# Altium schematic sheet karmanDB_transceiver.SchDoc
size A
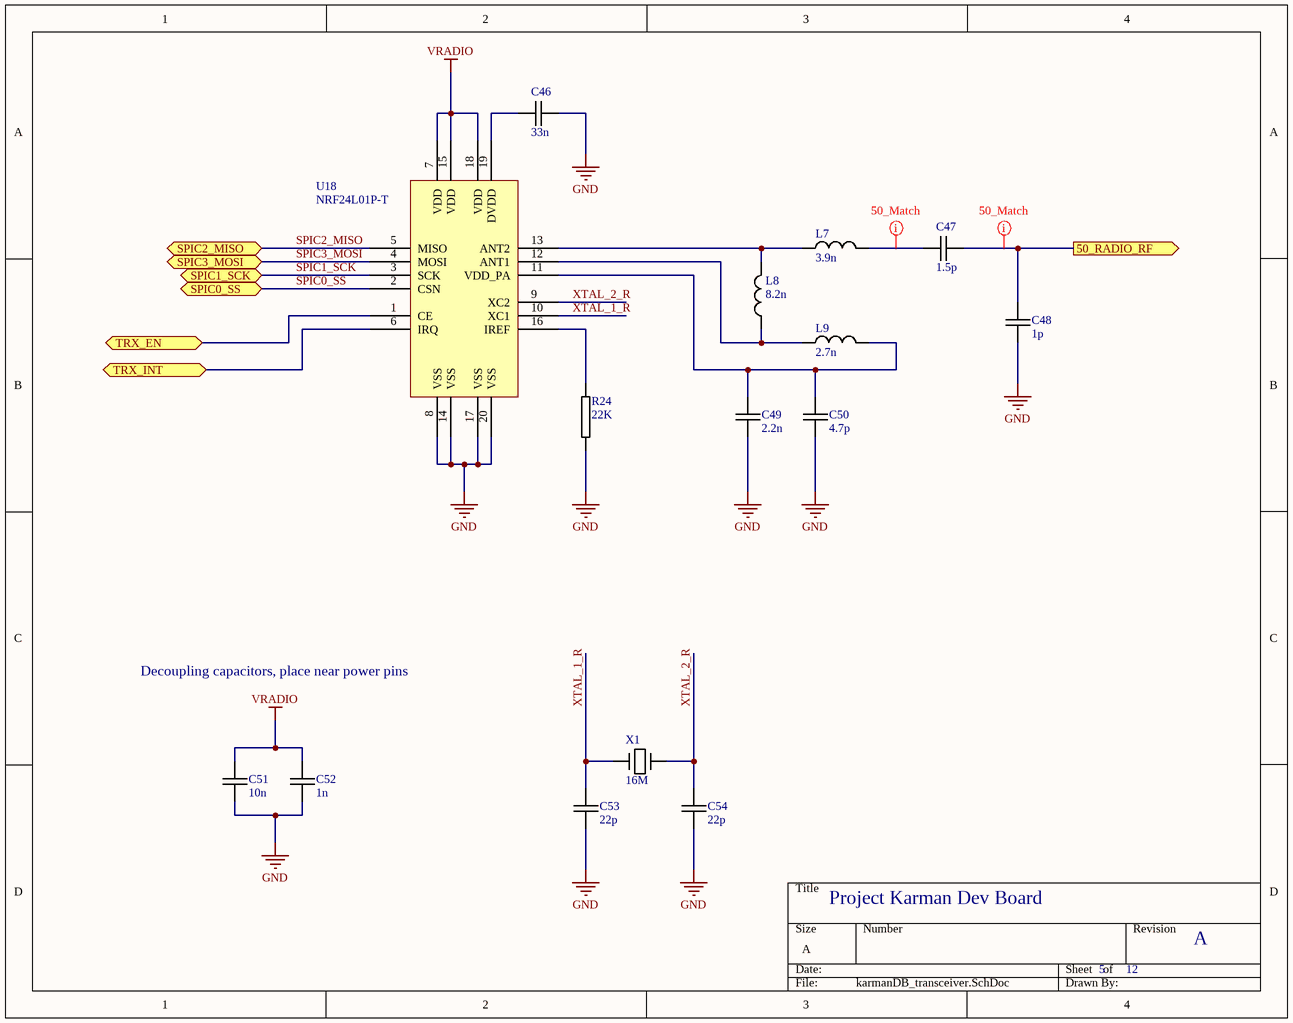
[diagram p0: karmanDB_transceiver.SchDoc]

## Parts
C46  33n  [MURATA_GRM_0603]
C47  1.5p  [MURATA_GRM_0402]
C48  1p  [MURATA_GRM_0402]
C49  2.2n  [MURATA_GRM_0402]
C50  4.7p  [MURATA_GRM_0402]
C51  10n  [MURATA_GRM_0603]
C52  1n  [MURATA_GRM_0603]
C53  22p  [MURATA_GRM_0603]
C54  22p  [MURATA_GRM_0603]
L7  3.9n  [PANASONIC_ELJRF]
L8  8.2n  [PANASONIC_ELJRF]
L9  2.7n  [PANASONIC_ELJRF]
R24  22K  [PANASONIC_ERJ3R]
U18  Manufacturer Part Number: NRF24L01P-T  [NORDIC_nRF24L01P]  (hidden comment: NORDIC_NRF24L01P)
X1  16M  [TXC_7B_SERIES]

## Ports
50_RADIO_RF (out), SPIC0_SS (bidir), SPIC1_SCK (bidir), SPIC2_MISO (bidir), SPIC3_MOSI (bidir), TRX_EN (bidir), TRX_INT (bidir)

## Nets
GND: C46.2 C48.2 C49.2 C50.2 C51.2 C52.2 C53.2 C54.2 R24.2 U18.8(VSS) U18.14(VSS) U18.17(VSS) U18.20(VSS) X1.PAD
VRADIO: C51.1 C52.1 U18.7(VDD) U18.15(VDD) U18.18(VDD)
50_RADIO_RF: C47.2 C48.1 ; port 50_RADIO_RF
SPIC0_SS: U18.2(CSN) ; port SPIC0_SS
SPIC1_SCK: U18.3(SCK) ; port SPIC1_SCK
SPIC2_MISO: U18.5(MISO) ; port SPIC2_MISO
SPIC3_MOSI: U18.4(MOSI) ; port SPIC3_MOSI
TRX_EN: U18.1(CE) ; port TRX_EN
TRX_INT: U18.6(IRQ) ; port TRX_INT
XTAL_1_R: C53.1 U18.10(XC1) X1.XTAL_P
XTAL_2_R: C54.1 U18.9(XC2) X1.XTAL_N
NetC46_1: C46.1 U18.19(DVDD)
NetC47_1: C47.1 L7.2
NetC49_1: C49.1 C50.1 L9.2 U18.11(VDD_PA)
NetL7_1: L7.1 L8.2 U18.13(ANT2)
NetL8_1: L8.1 L9.1 U18.12(ANT1)
NetR24_1: R24.1 U18.16(IREF)

## Layout directives
net class 50_Match_Class: 50_RADIO_RF, NetC47_1

## Notes on the sheet
- Decoupling capacitors, place near power pins
- Project Karman Dev Board
- 5
- 12
- A

## Library data of the parts
C46 = CAP_MURATA_GRM188R71C333KA01D: CAP CER 0.033UF 16V 10% X7R 0603; Manufacturer: Murata Electronics North America; Capacitance: 0.033µF; Supplier 1: Digi-Key; Supplier Part Number 1: 490-1528-1-ND; Manufacturer Part Number: GRM188R71C333KA01D; RoHS: RoHS Compliant; Category: Capacitors; Stock 1: 112656; Pricing: 1=0.1, 10=0.054, 50=0.0292, 100=0.0248, 250=0.02024, 500=0.01732, 1000=0.0135 (USD); Packaging: Cut Tape (CT); Tolerance: ±10%; Voltage - Rated: 16V; Temperature Coefficient: X7R; Mounting Type: Surface Mount, MLCC; Operating Temperature: -55°C ~ 125°C; Applications: General Purpose; Ratings: -; Package / Case: 0603 (1608 Metric); Size / Dimension: 0.063" L x 0.031" W (1.60mm x 0.80mm); Height - Seated (Max): -; Thickness (Max): 0.035" (0.90mm); Lead Spacing: -; Features: -; Lead Style: -; ComponentLink1URL: http://www.murata.com/~/media/webrenewal/support/library/catalog/products/capacitor/mlcc/c02e.ashx; ComponentLink1Description: http://www.murata.com/~/media/webrenewal/support/library/catalog/products/capacitor/mlcc/c02e.ashx
C47 = CAP_MURATA_GJM1555C1H1R5BB01D: CAP CER 1.5PF 50V NP0 0402; Manufacturer: Murata Electronics North America; Tolerance: ±0.1pF; Temperature Coefficient: C0G, NP0; Supplier 1: Digi-Key; Supplier Part Number 1: 490-8087-1-ND; Manufacturer Part Number: GJM1555C1H1R5BB01D; RoHS: RoHS Compliant; Category: Capacitors; Stock 1: 3662; Pricing: 1=0.2, 10=0.14, 50=0.0804, 100=0.0664, 250=0.05588, 500=0.04682, 1000=0.03768, 5000=0.03185 (USD); Packaging: Cut Tape (CT); Capacitance: 1.5pF; Voltage - Rated: 50V; Mounting Type: Surface Mount, MLCC; Operating Temperature: -55°C ~ 125°C; Applications: RF, Microwave, High Frequency; Ratings: -; Package / Case: 0402 (1005 Metric); Size / Dimension: 0.039" L x 0.020" W (1.00mm x 0.50mm); Height - Seated (Max): -; Thickness (Max): 0.022" (0.55mm); Lead Spacing: -; Features: High Q, Low Loss; Lead Style: -; ComponentLink1URL: http://www.murata.com/~/media/webrenewal/support/library/catalog/products/capacitor/mlcc/c02e.ashx; ComponentLink1Description: http://www.murata.com/~/media/webrenewal/support/library/catalog/products/capacitor/mlcc/c02e.ashx
C48 = CAP_MURATA_GJM1555C1H1R0BB01D: CAP CER 1PF 50V NP0 0402; Manufacturer: Murata Electronics North America; Tolerance: ±0.1pF; Temperature Coefficient: C0G, NP0; Supplier 1: Digi-Key; Supplier Part Number 1: 490-6073-1-ND; Manufacturer Part Number: GJM1555C1H1R0BB01D; RoHS: RoHS Compliant; Category: Capacitors; Stock 1: 74934; Pricing: 1=0.2, 10=0.14, 25=0.1048, 50=0.0804, 100=0.0664, 250=0.05588, 500=0.04682, 1000=0.03768, 5000=0.03185 (USD); Packaging: Cut Tape (CT); Capacitance: 1pF; Voltage - Rated: 50V; Mounting Type: Surface Mount, MLCC; Operating Temperature: -55°C ~ 125°C; Applications: RF, Microwave, High Frequency; Ratings: -; Package / Case: 0402 (1005 Metric); Size / Dimension: 0.039" L x 0.020" W (1.00mm x 0.50mm); Height - Seated (Max): -; Thickness (Max): 0.022" (0.55mm); Lead Spacing: -; Features: High Q, Low Loss; Lead Style: -; ComponentLink1URL: http://www.murata.com/~/media/webrenewal/support/library/catalog/products/capacitor/mlcc/c02e.ashx; ComponentLink1Description: http://www.murata.com/~/media/webrenewal/support/library/catalog/products/capacitor/mlcc/c02e.ashx
C49 = MURATA_GRM155R71C222KA01D: CAP CER 2200PF 16V 10% X7R 0402; Manufacturer: Murata Electronics North America; Supplier 1: Digi-Key; Supplier Part Number 1: 490-6330-1-ND; Manufacturer Part Number: GRM155R71C222KA01D; RoHS: RoHS Compliant; Category: Capacitors; Stock 1: 28283; Pricing: 1=0.1, 10=0.023, 25=0.016, 50=0.0124, 100=0.0105, 250=0.00856, 500=0.00732, 1000=0.0057, 5000=0.00475 (USD); Packaging: Cut Tape (CT); Capacitance: 2200pF; Tolerance: ±10%; Voltage - Rated: 16V; Temperature Coefficient: X7R; Mounting Type: Surface Mount, MLCC; Operating Temperature: -55°C ~ 125°C; Applications: General Purpose; Ratings: -; Package / Case: 0402 (1005 Metric); Size / Dimension: 0.039" L x 0.020" W (1.00mm x 0.50mm); Height - Seated (Max): -; Thickness (Max): 0.022" (0.55mm); Lead Spacing: -; Features: -; Lead Style: *; ComponentLink1URL: http://www.murata.com/~/media/webrenewal/support/library/catalog/products/capacitor/mlcc/c02e.ashx; ComponentLink1Description: http://www.murata.com/~/media/webrenewal/support/library/catalog/products/capacitor/mlcc/c02e.ashx
C50 = MURATA_GRM1555C1H4R7CA01D: CAP CER 4.7PF 50V NP0 0402; Manufacturer: Murata Electronics North America; Tolerance: ±0.25pF; Temperature Coefficient: C0G, NP0; Supplier 1: Digi-Key; Supplier Part Number 1: 490-5874-1-ND; Manufacturer Part Number: GRM1555C1H4R7CA01D; RoHS: RoHS Compliant; Category: Capacitors; Stock 1: 317555; Pricing: 1=0.1, 10=0.021, 50=0.0114, 100=0.0096, 250=0.00788, 500=0.00674, 1000=0.00525, 5000=0.00438 (USD); Packaging: Cut Tape (CT); Capacitance: 4.7pF; Voltage - Rated: 50V; Mounting Type: Surface Mount, MLCC; Operating Temperature: -55°C ~ 125°C; Applications: General Purpose; Ratings: -; Package / Case: 0402 (1005 Metric); Size / Dimension: 0.039" L x 0.020" W (1.00mm x 0.50mm); Height - Seated (Max): -; Thickness (Max): 0.022" (0.55mm); Lead Spacing: -; Features: -; Lead Style: -; ComponentLink1URL: http://www.murata.com/~/media/webrenewal/support/library/catalog/products/capacitor/mlcc/c02e.ashx; ComponentLink1Description: http://www.murata.com/~/media/webrenewal/support/library/catalog/products/capacitor/mlcc/c02e.ashx
C51 = CAP_MURATA_GRM188R71H103MA01D: CAP CER 10000PF 50V 20% X7R 0603; Manufacturer: Murata Electronics North America; Supplier 1: Digi-Key; Supplier Part Number 1: 490-1511-1-ND; Manufacturer Part Number: GRM188R71H103MA01D; RoHS: RoHS Compliant; Category: Capacitors; Stock 1: 188245; Pricing: 1=0.1, 10=0.018, 50=0.0098, 100=0.0083, 250=0.00676, 500=0.00578, 1000=0.0045 (USD); Packaging: Cut Tape (CT); Capacitance: 10000pF; Tolerance: ±20%; Voltage - Rated: 50V; Temperature Coefficient: X7R; Mounting Type: Surface Mount, MLCC; Operating Temperature: -55°C ~ 125°C; Applications: General Purpose; Ratings: -; Package / Case: 0603 (1608 Metric); Size / Dimension: 0.063" L x 0.031" W (1.60mm x 0.80mm); Height - Seated (Max): -; Thickness (Max): 0.035" (0.90mm); Lead Spacing: -; Features: -; Lead Style: -; ComponentLink1URL: http://www.murata.com/~/media/webrenewal/support/library/catalog/products/capacitor/mlcc/c02e.ashx; ComponentLink1Description: http://www.murata.com/~/media/webrenewal/support/library/catalog/products/capacitor/mlcc/c02e.ashx
C52 = CAP_MURATA_GRM188R71H102KA01D: CAP CER 1000PF 50V 10% X7R 0603; Manufacturer: Murata Electronics North America; Supplier 1: Digi-Key; Supplier Part Number 1: 490-1494-1-ND; Manufacturer Part Number: GRM188R71H102KA01D; RoHS: RoHS Compliant; Category: Capacitors; Stock 1: 1211591; Pricing: 1=0.1, 10=0.02, 50=0.0108, 100=0.0091, 250=0.00744, 500=0.00636, 1000=0.00495 (USD); Packaging: Cut Tape (CT); Capacitance: 1000pF; Tolerance: ±10%; Voltage - Rated: 50V; Temperature Coefficient: X7R; Mounting Type: Surface Mount, MLCC; Operating Temperature: -55°C ~ 125°C; Applications: General Purpose; Ratings: -; Package / Case: 0603 (1608 Metric); Size / Dimension: 0.063" L x 0.031" W (1.60mm x 0.80mm); Height - Seated (Max): -; Thickness (Max): 0.035" (0.90mm); Lead Spacing: -; Features: -; Lead Style: -; ComponentLink1URL: http://www.murata.com/~/media/webrenewal/support/library/catalog/products/capacitor/mlcc/c02e.ashx; ComponentLink1Description: http://www.murata.com/~/media/webrenewal/support/library/catalog/products/capacitor/mlcc/c02e.ashx
C53 C54 = CAP_MURATA_GRM1885C1H220JA01D: CAP CER 22PF 50V 5% NP0 0603; Manufacturer: Murata Electronics North America; Temperature Coefficient: C0G, NP0; Supplier 1: Digi-Key; Supplier Part Number 1: 490-1411-1-ND; Manufacturer Part Number: GRM1885C1H220JA01D; RoHS: RoHS Compliant; Category: Capacitors; Stock 1: 287854; Pricing: 1=0.1, 10=0.041, 50=0.0222, 100=0.0188, 250=0.0154, 500=0.01316, 1000=0.01026 (USD); Packaging: Cut Tape (CT); Capacitance: 22pF; Tolerance: ±5%; Voltage - Rated: 50V; Mounting Type: Surface Mount, MLCC; Operating Temperature: -55°C ~ 125°C; Applications: General Purpose; Ratings: -; Package / Case: 0603 (1608 Metric); Size / Dimension: 0.063" L x 0.031" W (1.60mm x 0.80mm); Height - Seated (Max): -; Thickness (Max): 0.035" (0.90mm); Lead Spacing: -; Features: -; Lead Style: -; ComponentLink1URL: http://www.murata.com/~/media/webrenewal/support/library/catalog/products/capacitor/mlcc/c02e.ashx; ComponentLink1Description: http://www.murata.com/~/media/webrenewal/support/library/catalog/products/capacitor/mlcc/c02e.ashx
L7 = PANASONIC_ELJ-RF3N9DFB: FIXED IND 3.9NH 360MA 150 MOHM; Manufacturer: Panasonic Electronic Components; Type: Multilayer; Material - Core: Non-Magnetic; Tolerance: ±0.3nH; Shielding: Unshielded; DC Resistance (DCR): 150 mOhm Max; Q @ Freq: 8 @ 100MHz; Frequency - Self Resonant: 5.2GHz; Frequency - Test: 100MHz; Supplier 1: Digi-Key; Supplier Part Number 1: PCD1930CT-ND; Manufacturer Part Number: ELJ-RF3N9DFB; RoHS: RoHS Compliant; Category: Inductors, Coils, Chokes; Stock 1: 11359; Pricing: 1=0.08, 10=0.074, 50=0.0698, 100=0.0651, 500=0.05116 (USD); Packaging: Cut Tape (CT); Inductance: 3.9nH; Current Rating: 360mA; Current - Saturation: -; Operating Temperature: -20°C ~ 85°C; Mounting Type: Surface Mount; Package / Case: 0402 (1005 Metric); Size / Dimension: 0.040" L x 0.024" W (1.00mm x 0.50mm); Height - Seated (Max): 0.022" (0.55mm); Supplier Device Package: 0402 (1005 Metric); ComponentLink1URL: http://industrial.panasonic.com/www-cgi/jvcr13pz.cgi?E+PZ+3+AGA0024+ELJRF3N9DFB+7+WW; ComponentLink1Description: http://industrial.panasonic.com/www-cgi/jvcr13pz.cgi?E+PZ+3+AGA0024+ELJRF3N9DFB+7+WW
L8 = PANASONIC_ELJ-RF8N2JFB: FIXED IND 8.2NH 320MA 350 MOHM; Manufacturer: Panasonic Electronic Components; Type: Multilayer; Material - Core: Non-Magnetic; Tolerance: ±5%; Shielding: Unshielded; DC Resistance (DCR): 350 mOhm Max; Q @ Freq: 8 @ 100MHz; Frequency - Self Resonant: 3.5GHz; Frequency - Test: 100MHz; Supplier 1: Digi-Key; Supplier Part Number 1: PCD1934CT-ND; Manufacturer Part Number: ELJ-RF8N2JFB; RoHS: RoHS Compliant; Category: Inductors, Coils, Chokes; Stock 1: 26730; Pricing: 1=0.08, 10=0.074, 50=0.0698, 100=0.0651, 500=0.05116 (USD); Packaging: Cut Tape (CT); Inductance: 8.2nH; Current Rating: 320mA; Current - Saturation: -; Operating Temperature: -20°C ~ 85°C; Mounting Type: Surface Mount; Package / Case: 0402 (1005 Metric); Size / Dimension: 0.040" L x 0.024" W (1.00mm x 0.50mm); Height - Seated (Max): 0.022" (0.55mm); Supplier Device Package: 0402 (1005 Metric); ComponentLink1URL: http://industrial.panasonic.com/www-cgi/jvcr13pz.cgi?E+PZ+3+AGA0024+ELJRF8N2JFB+7+WW; ComponentLink1Description: http://industrial.panasonic.com/www-cgi/jvcr13pz.cgi?E+PZ+3+AGA0024+ELJRF8N2JFB+7+WW
L9 = PANASONIC_ELJ-RF2N7ZFB: FIXED IND 2.7NH 400MA 100 MOHM; Manufacturer: Panasonic Electronic Components; Type: Multilayer; Material - Core: Non-Magnetic; Tolerance: ±0.2nH; Shielding: Unshielded; DC Resistance (DCR): 100 mOhm Max; Q @ Freq: 8 @ 100MHz; Frequency - Self Resonant: 5.5GHz; Frequency - Test: 100MHz; Supplier 1: Digi-Key; Supplier Part Number 1: PCD1903CT-ND; Manufacturer Part Number: ELJ-RF2N7ZFB; RoHS: RoHS Compliant; Category: Inductors, Coils, Chokes; Stock 1: 8911; Pricing: 1=0.1, 10=0.097, 50=0.0908, 100=0.0847, 500=0.06656 (USD); Packaging: Cut Tape (CT); Inductance: 2.7nH; Current Rating: 400mA; Current - Saturation: -; Operating Temperature: -20°C ~ 85°C; Mounting Type: Surface Mount; Package / Case: 0402 (1005 Metric); Size / Dimension: 0.040" L x 0.024" W (1.00mm x 0.50mm); Height - Seated (Max): 0.022" (0.55mm); Supplier Device Package: 0402 (1005 Metric); ComponentLink1URL: http://industrial.panasonic.com/www-cgi/jvcr13pz.cgi?E+PZ+3+AGA0024+ELJRF2N7ZFB+7+WW; ComponentLink1Description: http://industrial.panasonic.com/www-cgi/jvcr13pz.cgi?E+PZ+3+AGA0024+ELJRF2N7ZFB+7+WW
R24 = RES_PANASONIC_ERJ-3EKF2202V: RES SMD 22K OHM 1% 1/10W 0603; Manufacturer: Panasonic Electronic Components; Power (Watts): 0.1W, 1/10W; Temperature Coefficient: ±100ppm/°C; Supplier 1: Digi-Key; Supplier Part Number 1: P22.0KHCT-ND; Manufacturer Part Number: ERJ-3EKF2202V; RoHS: RoHS Compliant; Category: Resistors; Stock 1: 17812; Pricing: 1=0.1, 50=0.0114, 100=0.0084, 250=0.00644, 500=0.00514, 1000=0.00379 (USD); Packaging: Cut Tape (CT); Resistance (Ohms): 22k; Tolerance: ±1%; Composition: Thick Film; Features: Automotive AEC-Q200; Operating Temperature: -55°C ~ 155°C; Package / Case: 0603 (1608 Metric); Supplier Device Package: 0603; Size / Dimension: 0.063" L x 0.031" W (1.60mm x 0.80mm); Height: 0.022" (0.55mm); Number of Terminations: 2; ComponentLink1URL: http://industrial.panasonic.com/www-cgi/jvcr13pz.cgi?E+PZ+3+AOA0002+ERJ3EKF2202V+7+WW; ComponentLink1Description: http://industrial.panasonic.com/www-cgi/jvcr13pz.cgi?E+PZ+3+AOA0002+ERJ3EKF2202V+7+WW
U18 = NORDIC_NRF24L01P: IC RF TRANSCEIVER 2.4GHZ 20QFN; Manufacturer: Nordic Semiconductor ASA; Data Rate (Max): 2Mbps; Modulation or Protocol: GFSK; Power - Output: 0dBm; Sensitivity: -94dBm; Voltage - Supply: 1.9 V ~ 3.6 V; Current - Receiving: 13.5mA; Current - Transmitting: 11.3mA; Data Interface: PCB, Surface Mount; Supplier 1: Digi-Key; Supplier Part Number 1: 1490-1019-ND; RoHS: RoHS Compliant; Category: RF/IF and RFID; Stock 1: 2933; Pricing: 1=3.39, 10=3.03, 50=2.727, 100=2.4846, 250=2.2422, 500=2.01192, 1000=1.6968, 2500=1.61196, 5000=1.5453 (USD); Packaging: Tray; Frequency: 2.4GHz; Applications: General Purpose; Memory Size: -; Antenna Connector: PCB, Surface Mount; Operating Temperature: -40°C ~ 85°C; Package / Case: 20-VFQFN Exposed Pad; ComponentLink1URL: http://www.nordicsemi.com/eng/content/download/2726/34069/file/nRF24L01P_Product_Specification_1_0.pdf; ComponentLink1Description: http://www.nordicsemi.com/eng/content/download/2726/34069/file/nRF24L01P_Product_Specification_1_0.pdf
X1 = CRYSTAL_TXC_7B-16.000MAAE-T: CRYSTAL 16.0000MHZ 12PF SMD; Manufacturer: TXC CORPORATION; Frequency: 16MHz; Frequency Stability: ±30ppm; ESR (Equivalent Series Resistance): 40 Ohm; Operating Mode: Fundamental; Supplier 1: Digi-Key; Supplier Part Number 1: 887-2358-1-ND; Manufacturer Part Number: 7B-16.000MAAE-T; RoHS: RoHS Compliant; Category: Crystals and Oscillators; Stock 1: 1169; Pricing: 1=0.71, 10=0.629, 50=0.5876, 100=0.52, 500=0.4914 (USD); Packaging: Cut Tape (CT); Type: MHz Crystal; Frequency Tolerance: ±30ppm; Load Capacitance: 12pF; Operating Temperature: -20°C ~ 70°C; Ratings: -; Mounting Type: Surface Mount; Package / Case: 4-SMD, No Lead (DFN, LCC); Size / Dimension: 0.197" L x 0.126" W (5.00mm x 3.20mm); Height: 0.041" (1.05mm); ComponentLink1URL: http://www.txccrystal.com/images/pdf/7b.pdf; ComponentLink1Description: http://www.txccrystal.com/images/pdf/7b.pdf